# EAGLE schematic PIC24FJ256GB106_LAN (EAGLE 9.6.2)
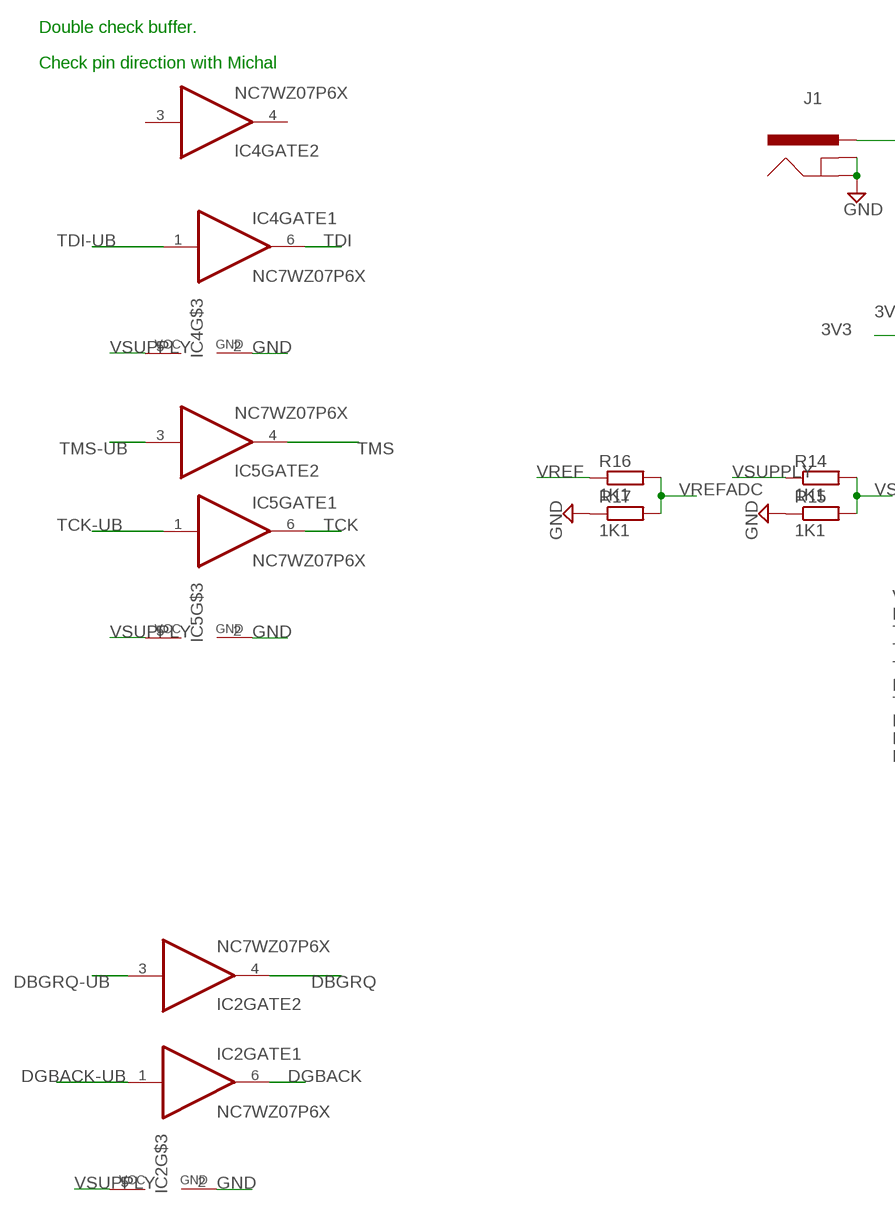
[diagram p0: schematic, sheet 1, part 1 of 2]
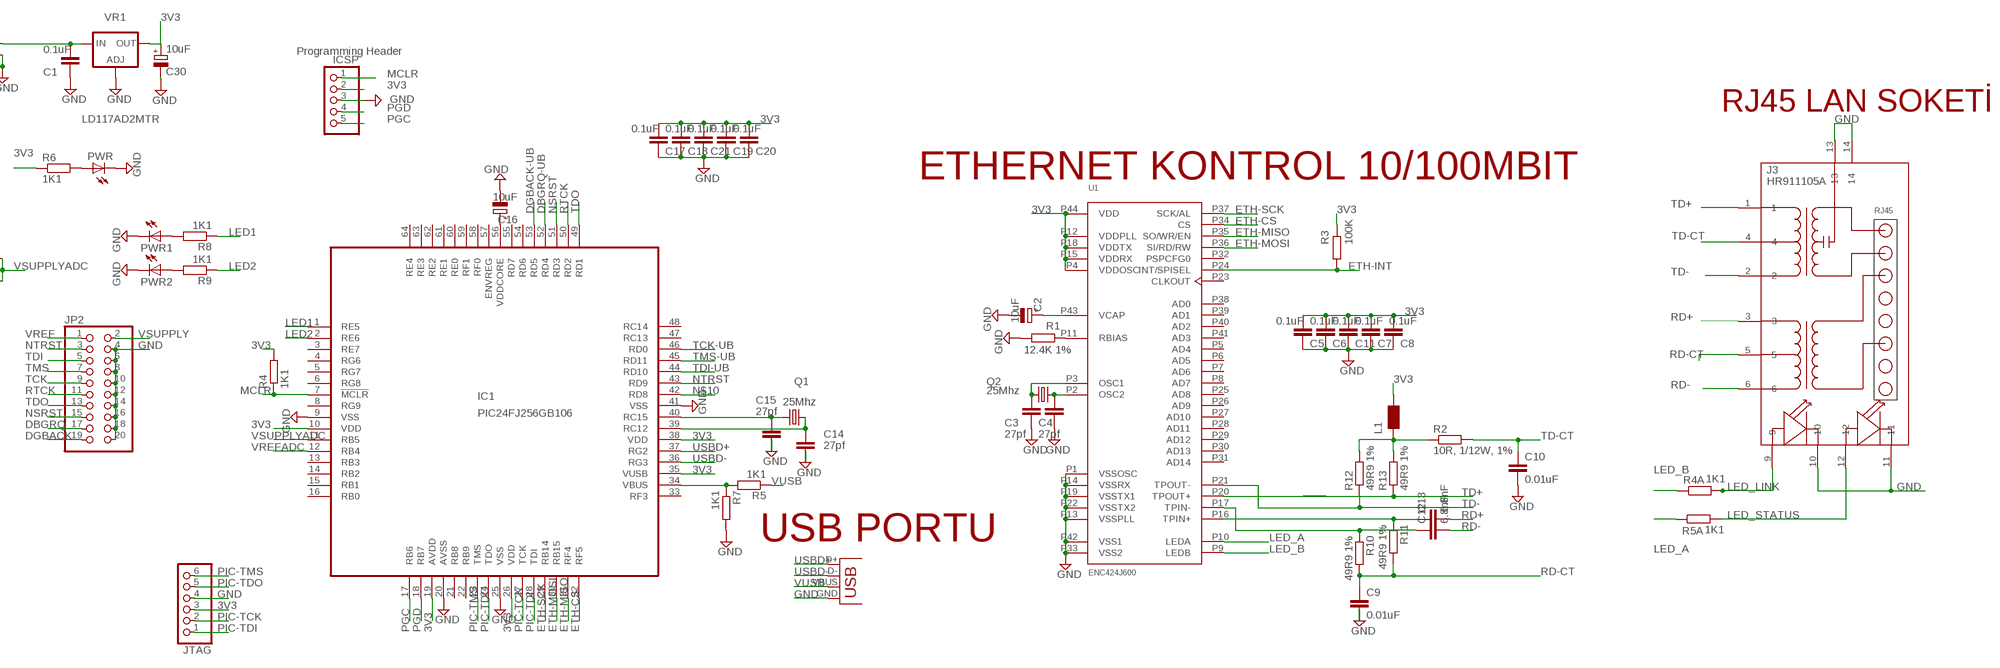
[diagram p1: schematic, sheet 1, part 2 of 2]

## Parts
C1  0.1uF  C-EUC0603  [C0603]
C2  10uF  CPOL-EUSMCA  [SMC_A]
C3  27pf  C-EUC0603  [C0603]
C4  27pf  C-EUC0603  [C0603]
C5  0.1uF  C-EUC0603  [C0603]
C6  0.1uF  C-EUC0603  [C0603]
C7  0.1uF  C-EUC0603  [C0603]
C8  0.1uF  C-EUC0603  [C0603]
C9  0.01uF  C-EUC0603  [C0603]
C10  0.01uF  C-EUC0603  [C0603]
C11  0.1uF  C-EUC0603  [C0603]
C12  6.8nF  C-EUC0603  [C0603]
C13  6.8nF  C-EUC0603  [C0603]
C14  27pf  C-EUC0603  [C0603]
C15  27pf  C-EUC0603  [C0603]
C16  10uF  CPOL-EUSMCA  [SMC_A]
C17  0.1uF  C-EUC0603  [C0603]
C18  0.1uF  C-EUC0603  [C0603]
C19  0.1uF  C-EUC0603  [C0603]
C20  0.1uF  C-EUC0603  [C0603]
C21  0.1uF  C-EUC0603  [C0603]
C30  10uF  CPOL-EUSMCA  [SMC_A]
IC1  PIC24FJ256GB106  [TQFP64-10X10]
IC2  NC7WZ07P6X  [SC70-6]
IC4  NC7WZ07P6X  [SC70-6]
IC5  NC7WZ07P6X  [SC70-6]
ICSP  PINHD-1X5  [1X05]
J1  POWER_JACKSMD  [POWER_JACK_SMD]
J3  HR911105A  [HR911105A]
JP2  PINHD-2X10  [2X10]
JTAG  PINHD-1X6  [1X06]
L1  WE-KIL_0805  [WE-KI_0805_B]
PWR  LEDCHIPLED_0603  [CHIPLED_0603]
PWR1  LEDCHIPLED_0603  [CHIPLED_0603]
PWR2  LEDCHIPLED_0603  [CHIPLED_0603]
Q1  25Mhz  CRYSTALHC49UP  [HC49UP]
Q2  25Mhz  CRYSTALHC49UP  [HC49UP]
R1  12.4K 1%  R-EU_R0603  [R0603]
R2  10R, 1/12W, 1%  R-EU_R0603  [R0603]
R3  100K  R-EU_R0603  [R0603]
R4  1K1  R-EU_R0603  [R0603]
R4A  1K1  R-EU_R0603  [R0603]
R5  1K1  R-EU_R0603  [R0603]
R5A  1K1  R-EU_R0603  [R0603]
R6  1K1  R-EU_R0603  [R0603]
R7  1K1  R-EU_R0603  [R0603]
R8  1K1  R-EU_R0603  [R0603]
R9  1K1  R-EU_R0603  [R0603]
R10  49R9 1%  R-EU_R0603  [R0603]
R11  49R9 1%  R-EU_R0603  [R0603]
R12  49R9 1%  R-EU_R0603  [R0603]
R13  49R9 1%  R-EU_R0603  [R0603]
R14  1K1  R-EU_R0603  [R0603]
R15  1K1  R-EU_R0603  [R0603]
R16  1K1  R-EU_R0603  [R0603]
R17  1K1  R-EU_R0603  [R0603]
U1  ENC424J600  [TQFP44]
VR1  LD117AD2MTR  [D2PACK]
X2  USBSMD  [USB-MINIB]

## Nets
3V3: C5.1 C6.1 C7.1 C8.1 C11.1 C17.1 C18.1 C19.1 C20.1 C21.1 C30.+ IC1.10(VDD) IC1.19(AVDD) IC1.26(VDD) IC1.35(VUSB) IC1.38(VDD) ICSP.2 JTAG.3 L1.1 R3.1 R4.2 R6.1 U1.P4(VDDOSC) U1.P12(VDDPLL) U1.P15(VDDRX) U1.P18(VDDTX) U1.P44(VDD) VR1.2(OUT)
CCT: L1.2 R2.1 R12.2 R13.2
DBGRQ: IC2.4(GATE2:O) JP2.17
DBGRQ-UB: IC1.52(RD4) IC2.3(GATE2:I)
DGBACK: IC2.6(GATE1:O) JP2.19
DGBACK-UB: IC1.53(RD5) IC2.1(GATE1:I)
DSFGDF: C12.1 R10.1 U1.P17(TPIN-)
DSGDFSG: C13.1 R11.1 U1.P16(TPIN+)
ETH-CS: IC1.32(RF5) U1.P34(CS)
ETH-INT: R3.2 U1.P24(INT/SPISEL)
ETH-MISO: IC1.31(RF4) U1.P35(SO/WR/EN)
ETH-MOSI: IC1.30(RB15) U1.P36(SI/RD/RW)
ETH-SCK: IC1.29(RB14) U1.P37(SCK/AL)
GND: C1.2 C2.- C3.2 C4.2 C5.2 C6.2 C7.2 C8.2 C9.2 C10.2 C11.2 C14.2 C15.2 C16.- C17.2 C18.2 C19.2 C20.2 C21.2 C30.- IC1.9(VSS) IC1.20(AVSS) IC1.25(VSS) IC1.41(VSS) IC2.2(GND) IC4.2(GND) IC5.2(GND) ICSP.3 J1.GND(GNDBREAK) J1.P$4(GND) J3.10 J3.11 J3.13 J3.14 JP2.4 JP2.6 JP2.8 JP2.10 JP2.12 JP2.14 JP2.16 JP2.18 JP2.20 JTAG.4 PWR1.C PWR2.C PWR.C R1.2 R7.2 R15.1 R17.1 U1.P1(VSSOSC) U1.P13(VSSPLL) U1.P14(VSSRX) U1.P19(VSSTX1) U1.P22(VSSTX2) U1.P33(VSS2) U1.P42(VSS1) VR1.1(ADJ) X2.GND
LED1: IC1.1(RE5) R8.1
LED2: IC1.2(RE6) R9.1
LED_A: R5A.1 U1.P10(LEDA)
LED_B: R4A.1 U1.P9(LEDB)
LED_LINK: J3.9 R4A.2
LED_STATUS: J3.12 R5A.2
MCLR: IC1.7(!MCLR) ICSP.1 R4.1
N$1: C2.+ U1.P43(VCAP)
N$2: R1.1 U1.P11(RBIAS)
N$3: C15.1 IC1.40(RC15) Q1.1
N$4: C3.1 Q2.1 U1.P3(OSC1)
N$5: C14.1 IC1.39(RC12) Q1.2
N$6: PWR1.A R8.2
N$7: PWR2.A R9.2
N$8: C4.1 Q2.2 U1.P2(OSC2)
N$9: C16.+ IC1.56(VDDCORE)
N$10: IC1.42(RD8)
N$11: IC1.34(VBUS) R5.2 R7.1
N$29: PWR.A R6.2
NSRST: IC1.51(RD3) JP2.15
NTRST: IC1.43(RD9) JP2.3
PGC: IC1.17(RB6) ICSP.5
PGD: IC1.18(RB7) ICSP.4
PIC-TCK: IC1.27(TCK) JTAG.2
PIC-TDI: IC1.28(TDI) JTAG.1
PIC-TDO: IC1.24(TDO) JTAG.5
PIC-TMS: IC1.23(TMS) JTAG.6
RD+: C13.2 J3.3
RD-: C12.2 J3.6
RD-CT: C9.1 J3.5 R10.2 R11.2
RTCK: IC1.50(RD2) JP2.11
TCK: IC5.6(GATE1:O) JP2.9
TCK-UB: IC1.46(RD0) IC5.1(GATE1:I)
TD+: J3.1 R13.1 U1.P20(TPOUT+)
TD-: J3.2 R12.1 U1.P21(TPOUT-)
TD-CT: C10.1 J3.4 R2.2
TDI: IC4.6(GATE1:O) JP2.5
TDI-UB: IC1.44(RD10) IC4.1(GATE1:I)
TDO: IC1.49(RD1) JP2.13
TMS: IC5.4(GATE2:O) JP2.7
TMS-UB: IC1.45(RD11) IC5.3(GATE2:I)
USBD+: IC1.37(RG2) X2.D+
USBD-: IC1.36(RG3) X2.D-
VBAT: C1.1 J1.VIN0(PWR) VR1.3(IN)
VREF: JP2.1 R16.1
VREFADC: IC1.12(RB4) R16.2 R17.2
VSUPPLY: IC2.5(VCC) IC4.5(VCC) IC5.5(VCC) JP2.2 R14.1
VSUPPLYADC: IC1.11(RB5) R14.2 R15.2
VUSB: R5.1 X2.VBUS
Unconnected: IC1.3(RE7) IC1.4(RG6) IC1.5(RG7) IC1.6(RG8) IC1.8(RG9) IC1.13(RB3) IC1.14(RB2) IC1.15(RB1) IC1.16(RB0) IC1.21(RB8) IC1.22(RB9) IC1.33(RF3) IC1.47(RC13) IC1.48(RC14) IC1.54(RD6) IC1.55(RD7) IC1.57(ENVREG) IC1.58(RF0) IC1.59(RF1) IC1.60(RE0) IC1.61(RE1) IC1.62(RE2) IC1.63(RE3) IC1.64(RE4) IC4.3(GATE2:I) IC4.4(GATE2:O) U1.P5(AD4) U1.P6(AD5) U1.P7(AD6) U1.P8(AD7) U1.P23(CLKOUT) U1.P25(AD8) U1.P26(AD9) U1.P27(AD10) U1.P28(AD11) U1.P29(AD12) U1.P30(AD13) U1.P31(AD14) U1.P32(PSPCFG0) U1.P38(AD0) U1.P39(AD1) U1.P40(AD2) U1.P41(AD3)

## Notes on the sheet
- PIC24FJ256GB106 16-BIT MCU VE 100 MEGABIT LAN KARTI
- Double check buffer.
- Check pin direction with Michal
- J1
- Programming Header
- RJ45 LAN SOKETİ
- ETHERNET KONTROL 10/100MBIT
- USB PORTU

## Library data of the parts
C1 C3-C15 C17-C21 = rcl:C-EU: CAPACITOR, European symbol
C2 C16 C30 = rcl:CPOL-EU: POLARIZED CAPACITOR, European symbol
IC1 = microchip:PIC24FJ256GB106: PIC24FJ256GB106 edit this description Auto generated by make-symbol-device-package-bsdl.ulp Rev. 25 Source: PIC24FJ256GB106.bsd
IC2 IC4 IC5 = GadgetFactory:NC7WZ07P6X: Dual line drivers with 3-state outputs.
ICSP = pinhead-2:PINHD-1X5: PIN HEADER
J1 = SparkFun:POWER_JACK: Power Jack This is the standard 5.5mm barrel jack for power. The PTH is the most common, proven, reliable, footprint. All others are experimental. The Slot footprint only works if the mill layer is transmitted to the PCB fab house so be warned. Spark Fun Electronics SKU : PRT-00119. Mating wall wart : TOL-00298 (and others)
J3 = CONNECTER:HR911105A
JP2 = pinhead-2:PINHD-2X10: PIN HEADER
JTAG = pinhead-2:PINHD-1X6: PIN HEADER
L1 = wuerth-elektronik:WE-KIL: SMD Wire Wound Ceramic Inductor WE-KIL - Low profile - High Q values -- Bluetooth -- Wireless LAN -- RF oscillation circuit -- IF impedance matching
PWR PWR1 PWR2 = led:LED: LED OSRAM: - CHIPLED LG R971, LG N971, LY N971, LG Q971, LY Q971, LO R971, LY R971 LH N974, LH R974 LS Q976, LO Q976, LY Q976 LO Q996 - Hyper CHIPLED LW Q18S LB Q993, LB Q99A, LB R99A - SideLED LS A670, LO A670, LY A670, LG A670, LP A670 LB A673, LV A673, LT A673, LW A673 LH A674 LY A675 LS A676, LA A676, LO A676, LY A676, LW A676 LS A679, LY A679, LG A679 - Hyper Micro SIDELED® LS Y876, LA Y876, LO Y876, LY Y876 LT Y87S - SmartLED LW L88C, LW L88S LB L89C, LB L89S, LG L890 LS L89K, LO L89K, LY L89K LS L896, LA L896, LO L896, LY L896 - TOPLED LS T670, LO T670, LY T670, LG T670, LP T670 LSG T670, LSP T670, LSY T670, LOP T670, LYG T670 LG T671, LOG T671, LSG T671 LB T673, LV T673, LT T673, LW T673 LH T674 LS T676, LA T676, LO T676, LY T676, LB T676, LH T676, LSB T676, LW T676 LB T67C, LV T67C, LT T67C, LS T67K, LO T67K, LY T67K, LW E67C LS E67B, LA E67B, LO E67B, LY E67B, LB E67C, LV E67C, LT E67C LW T67C LS T679, LY T679, LG T679 LS T770, LO T770, LY T770, LG T770, LP T770 LB T773, LV T773, LT T773, LW T773 LH T774 LS E675, LA E675, LY E675, LS T675 LS T776, LA T776, LO T776, LY T776, LB T776 LHGB T686 LT T68C, LB T68C - Hyper Mini TOPLED® LB M676 - Mini TOPLED Santana® LG M470 LS M47K, LO M47K, LY M47K Source: http://www.osram.convergy.de LUXEON: - LUMILED® LXK2-PW12-R00, LXK2-PW12-S00, LXK2-PW14-U00, LXK2-PW14-V00 LXK2-PM12-R00, LXK2-PM12-S00, LXK2-PM14-U00 LXK2-PE12-Q00, LXK2-PE12-R00, LXK2-PE12-S00, LXK2-PE14-T00, LXK2-PE14-U00 LXK2-PB12-K00, LXK2-PB12-L00, LXK2-PB12-M00, LXK2-PB14-N00, LXK2-PB14-P00, LXK2-PB14-Q00 LXK2-PR12-L00, LXK2-PR12-M00, LXK2-PR14-Q00, LXK2-PR14-R00 LXK2-PD12-Q00, LXK2-PD12-R00, LXK2-PD12-S00 LXK2-PH12-R00, LXK2-PH12-S00 LXK2-PL12-P00, LXK2-PL12-Q00, LXK2-PL12-R00 Source: www.luxeon.com KINGBRIGHT: KA-3528ASYC Source: www.kingbright.com
Q1 Q2 = crystal:CRYSTAL: CRYSTAL
R1-R4 R4A R5 R5A R6-R17 = rcl:R-EU_: RESISTOR, European symbol
U1 = dp_devices:ENC424J600: Stand-Alone 10/100 Ethernet Controller with SPI or Parallel Interface Source: http://ww1.microchip.com/downloads/en/DeviceDoc/39935c.pdf
VR1 = v-reg:LD117A?*: Low drop fixed and adjustable positive voltage regulators 1 A Source: http://www.st.com/stonline/products/literature/ds/7194/ld1117axx.pdf
X2 = SparkFun:USB: USB Connectors USB-B-PTH is fully proven SKU : PRT-00139 USB-miniB is fully proven SKU : PRT-00587 USB-A-PCB is untested. USB-A-H is throughly reviewed, but untested. Spark Fun Electronics SKU : PRT-00437 USB-B-SMT is throughly reviewed, but untested. Needs silkscreen touching up. USB-A-S has not been used/tested USB-MB-H has not been used/tested